# Altium project Master.PrjPcb
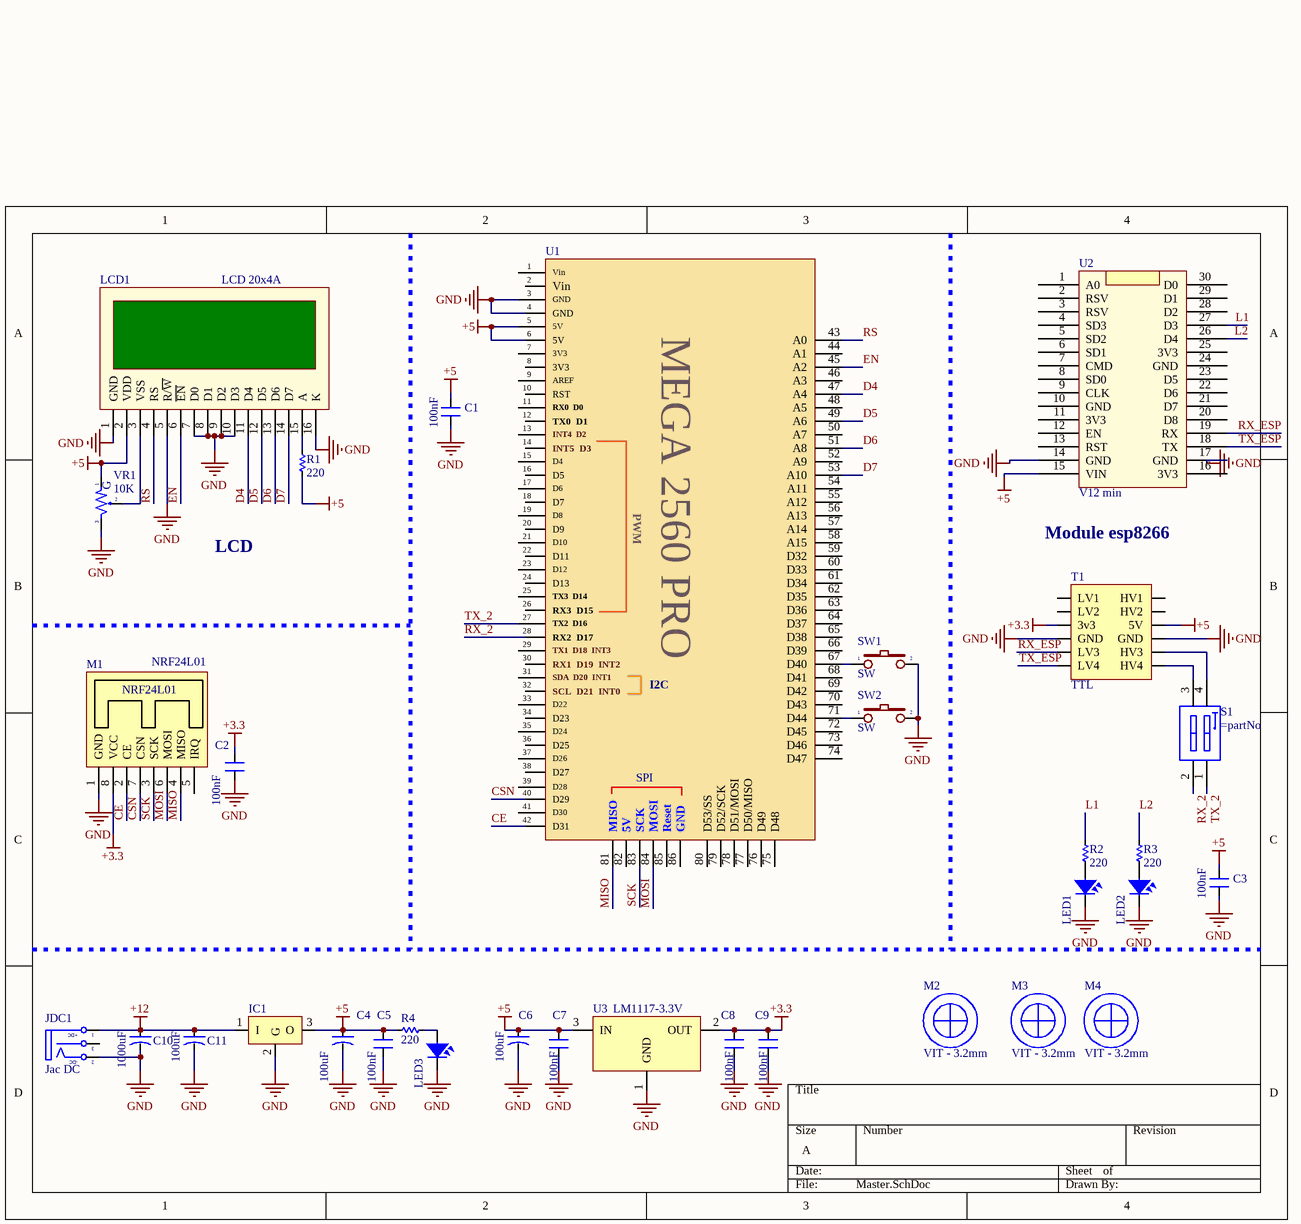
[diagram p0: Master.SchDoc]
1 sheet, 33 parts. Net scope: global (net labels, ports and power ports of the same name join across sheets).
Board file: Master.PcbDoc

## Sheet Master.SchDoc
size A

### Parts
C1  100nF  [CN1.5]
C2  100nF  [CN1.5]
C3  100nF  [CN1.5]
C4  100uF  [CA-ALU-5]
C5  100nF  [CN1.5]
C6  100uF  [CA-ALU-5]
C7  100nF  [CN1.5]
C8  100nF  [CN1.5]
C9  100nF  [CN1.5]
C10  1000uF  [CA-ALU-6.3]
C11  100uF  [CA-ALU-5]
IC1  LM78xx  [TO220-123]  (value not drawn)
JDC1  Jac DC  [DC0]
LCD1  LCD 20x4A  [LCD20X4A]
LED1  LED  [LED-3MM-RED]  (value not drawn)
LED2  LED  [LED-3MM-RED]  (value not drawn)
LED3  LED  [LED-3MM-RED]  (value not drawn)
M1  NRF24L01  [NRF24L01]
M2  VIT - 3.2mm  [VIT - 3.2MM_2]
M3  VIT - 3.2mm  [VIT - 3.2MM_2]
M4  VIT - 3.2mm  [VIT - 3.2MM_2]
R1  220  [RES-1/4W-SMALL]
R2  220  [RES-1/4WD]
R3  220  [RES-1/4WD]
R4  220  [RES-1/4W]
S1  (no value)  [SW-DIP2]
SW1  SW  [SW1-DIP]
SW2  SW  [SW1-DIP]
T1  TTL  [TTL]
U1  Le Quoc Huy  [Arduino Mega Pro Mini]  (value not drawn)
U2  V12 min  [Module ESP 8266_min]
U3  LM1117-3.3V  [SOT223]
VR1  10K  [VR-S3]

### Nets
+3.3: C2.2 C8.2 C9.2 M1.8(VCC) T1.3(3v3) U3.2(OUT)
+5: C1.2 C3.2 C4.1 C5.2 C6.1 C7.2 IC1.3(O) LCD1.2(VDD) R1.2 R4.2 T1.10(5V) U1.5(5V) U1.6(5V) U2.15(VIN) U3.3(IN) VR1.1
+12: C10.1 C11.1 IC1.1(I) JDC1.1(T)
GND: C1.1 C2.1 C3.1 C4.2 C5.1 C6.2 C7.1 C8.1 C9.1 C10.2 C11.2 IC1.2(G) JDC1.2(TN) LCD1.1(GND) LCD1.5(R/~{W}) LCD1.7(D0) LCD1.8(D1) LCD1.9(D2) LCD1.10(D3) LCD1.16(K) LED1.2 LED2.2 LED3.2 M1.1(GND) SW1.2 SW2.2 T1.4(GND) T1.9(GND) U1.3(GND) U1.4(GND) U2.14(GND) U2.17(GND) U3.1(GND) VR1.3
CE: M1.2(CE) U1.42(D31)
CSN: M1.7(CSN) U1.40(D29)
D4: LCD1.11(D4) U1.47(A4)
D5: LCD1.12(D5) U1.49(A6)
D6: LCD1.13(D6) U1.51(A8)
D7: LCD1.14(D7) U1.53(A10)
EN: LCD1.6(~{EN}) U1.45(A2)
L1: R2.2 U2.27(D3)
L2: R3.2 U2.26(D4)
MISO: M1.4(MISO) U1.81(MISO)
MOSI: M1.6(MOSI) U1.84(MOSI)
RS: LCD1.4(RS) U1.43(A0)
RX_2: S1.2 U1.28(RX2__D17)
RX_ESP: T1.5(LV3) U2.19(RX)
SCK: M1.3(SCK) U1.83(SCK)
TX_2: S1.1 U1.27(TX2__D16)
TX_ESP: T1.6(LV4) U2.18(TX)
NetLCD1_3: LCD1.3(VSS) VR1.2
NetLCD1_15: LCD1.15(A) R1.1
NetLED1_1: LED1.1 R2.1
NetLED2_1: LED2.1 R3.1
NetLED3_1: LED3.1 R4.1
NetS1_3: S1.3 T1.7(HV4)
NetS1_4: S1.4 T1.8(HV3)
NetSW1_1: SW1.1 U1.67(D40)
NetSW2_1: SW2.1 U1.71(D44)

Not connected (* = marked no-connect by the designer): JDC1 3(S); M1 5(IRQ); T1 1(LV1) 2(LV2) 11(HV2) 12(HV1); U1 1(Vin) 2(Vin) 7(3V3) 8(3V3) 9(AREF) 10(RST) 11(RX0__D0) 12(TX0__D1) 13(INT4__D2) 14(INT5__D3) 15(D4) 16(D5) 17(D6) 18(D7) 19(D8) 20(D9) 21(D10) 22(D11) 23(D12) 24(D13) 25(TX3__D14) 26(RX3__D15) 29(TX1__D18__INT3) 30(RX1__D19__INT2) 31(SDA__D20__INT1) 32(SCL__D21__INT0) 33(D22) 34(D23) 35(D24) 36(D25) 37(D26) 38(D27) 39(D28) 41(D30) 44(A1) 46(A3) 48(A5) 50(A7) 52(A9) 54(A11) 55(A12) 56(A13) 57(A14) 58(A15) 59(D32) 60(D33) 61(D34) 62(D35) 63(D36) 64(D37) 65(D38) 66(D39) 68(D41) 69(D42) 70(D43) 72(D45) 73(D46) 74(D47) 75(D48) 76(D49) 77(D50/MISO) 78(D51/MOSI) 79(D52/SCK) 80(D53/SS) 82(5V) 85(Reset) 86(GND); U2 1(A0) 2(RSV) 3(RSV) 4(SD3) 5(SD2) 6(SD1) 7(CMD) 8(SD0) 9(CLK) 10(GND) 11(3V3) 12(EN) 13(RST) 16(3V3) 20(D8) 21(D7) 22(D6) 23(D5) 24(GND) 25(3V3) 28(D2) 29(D1) 30(D0)

### Notes on the sheet
- LCD
- Module esp8266
- (in symbol Arduino mega 2560 Pro) MEGA 2560 PRO; PWM; I2C; SPI
- (in symbol DCIN) +DC; -DC
- (in symbol VR-S) G

### Library data of the parts
C1-C3 C5 C7-C9 = CN: Value: 33pF
C4 C6 C10 C11 = CN-ALU-DIP: Capacitor (Semiconductor SIM Model); Value: 104; LatestRevisionDate: 17-Jul-2002; LatestRevisionNote: Re-released for DXP Platform.; PackageReference: C1206; Publisher: Altium Limited
IC1 = LM78xx: Positive Voltage Regulator; Note: Tab is connected to pin 3 (GND).; Published: 24-Aug-2001; LatestRevisionDate: 17-Jul-2002; LatestRevisionNote: Re-released for DXP Platform.; DatasheetVersion: Apr-1994; PackageVersion: Jul-1998; PackageReference: ISOWATT220AB; Publisher: Altium Limited; PackageDescription: TO, Thru-Hole, Vertical, Heatsink Mounted; 3 In-Line Leads; Pitch 2.54 mm; Pin sequence 1, 3, 2; ComponentLink1Description: Manufacturer Link; ComponentLink1URL: http://www.st.com/; ComponentLink2Description: Datasheet; ComponentLink2URL: http://www.st.com/stonline/products/literature/ds/2146/l78m05c.pdf
JDC1 = DCIN: Jac DC input; Value: Jac DC
LCD1 = LCD20x4A: LCD dipslay 20 char, 4 line; Value: Jum 40; Value: LCD 20x4A
LED1-LED3 = LED: LED Single colour Green and Red; Value: LED 3 ly Single Colour
R1-R4 = Res: Manufacturer: Generic Components; Class: Passive; SubClass: R; Published: 08/06/2000; Publisher: Altium Hobart Technology Centre
S1 = SWDIP2: WS-DITV 2.54 mm small compact THT flat actuator with top tape; Manufacturer: Wurth Elektronik; Part No.: 418127160902; ComponentLink1 Description: Manufacturer; ComponentLink2 Description: Datasheet; Pole: 02; Created Date: Dec.2015; ComponentLink1URL: http://www.we-online.com; ComponentLink2URL: http://katalog.we-online.de/em/datasheet/4181271609xx.pdf; Created by: Baojun Chen
SW1 SW2 = SW2: Switch button 2 pin; Value: SW chip 2 pin
T1 = TTL: WR-PHD 2.54 mm Dual Socket Header; Manufacturer: W¨¹rth Elektronik eiSos GmbH; partNo: 61301221821; ComponentLink1 Description: Manufacturer; ComponentLink2 Description: Datasheet; NoPins: 12; Created Date: 29 March 2013; ComponentLink1URL: http://www.we-online.com; ComponentLink2URL: http://katalog.we-online.de/em/datasheet/6130xx21821.pdf; Created by: Karrer Zheng
U1 = Arduino mega 2560 Pro
U2 = Module ESP8266
U3 = LM1117: 800mA Low-Dropout Linear Regulator; Creator: Nguyen Ba Bien; Website: http://group3i.net
VR1 = VR-S: Var Resistor; Value: Volume 50k